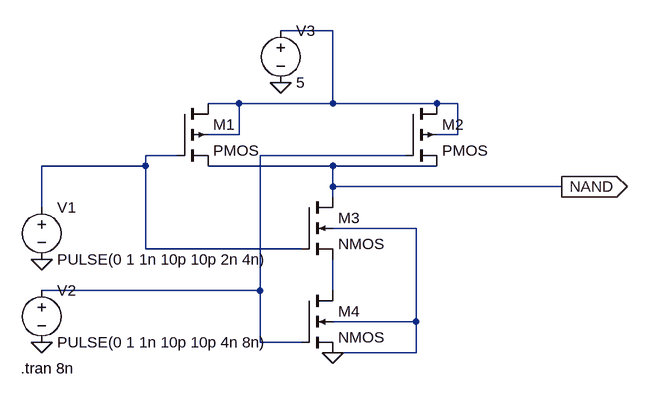
[diagram p0: schematic Nand.asc]
Nand.asc, the LTspice schematic file:
Version 4
SHEET 1 880 680
WIRE 384 -144 304 -144
WIRE 240 -32 192 -32
WIRE 384 -32 384 -144
WIRE 384 -32 240 -32
WIRE 544 -32 384 -32
WIRE 576 -32 544 -32
WIRE 240 16 240 -32
WIRE 240 16 192 16
WIRE 576 16 576 -32
WIRE 576 16 544 16
WIRE 144 48 96 48
WIRE 496 48 272 48
WIRE 96 64 96 48
WIRE 96 64 -64 64
WIRE 384 64 192 64
WIRE 544 64 384 64
WIRE 384 96 384 64
WIRE 736 96 384 96
WIRE 384 112 384 96
WIRE -64 128 -64 64
WIRE 512 160 384 160
WIRE 96 192 96 64
WIRE 336 192 96 192
WIRE 272 256 272 48
WIRE 272 256 -64 256
WIRE 384 256 384 208
WIRE 512 304 512 160
WIRE 512 304 384 304
WIRE 272 336 272 256
WIRE 336 336 272 336
WIRE 512 352 512 304
WIRE 512 352 384 352
FLAG 304 -64 0
FLAG 384 352 0
FLAG 736 96 NAND
IOPIN 736 96 Out
FLAG -64 336 0
FLAG -64 208 0
SYMBOL voltage 304 -160 R0
WINDOW 123 0 0 Left 0
WINDOW 39 0 0 Left 0
SYMATTR InstName V3
SYMATTR Value 5
SYMBOL pmos4 144 -32 R0
SYMATTR InstName M1
SYMBOL pmos4 496 -32 R0
SYMATTR InstName M2
SYMBOL nmos4 336 112 R0
SYMATTR InstName M3
SYMBOL nmos4 336 256 R0
SYMATTR InstName M4
SYMBOL voltage -64 112 R0
WINDOW 123 0 0 Left 0
WINDOW 39 0 0 Left 0
SYMATTR InstName V1
SYMATTR Value PULSE(0 1 1n 10p 10p 2n 4n)
SYMBOL voltage -64 240 R0
WINDOW 123 0 0 Left 0
WINDOW 39 0 0 Left 0
SYMATTR InstName V2
SYMATTR Value PULSE(0 1 1n 10p 10p 4n 8n)
TEXT -96 376 Left 2 !.tran 8n

The netlist it stands for:
* Nand.asc
V3 N001 0 5
M1 N001 N002 NAND N001 PMOS
M2 N001 N003 NAND N001 PMOS
M3 NAND N002 N004 0 NMOS
M4 N004 N003 0 0 NMOS
V1 N002 0 PULSE(0 1 1n 10p 10p 2n 4n)
V2 N003 0 PULSE(0 1 1n 10p 10p 4n 8n)
.model NMOS NMOS
.model PMOS PMOS
.lib standard.mos
.tran 8n
.backanno
.end